# EAGLE schematic FR4 6.0 (EAGLE 7.2.0)
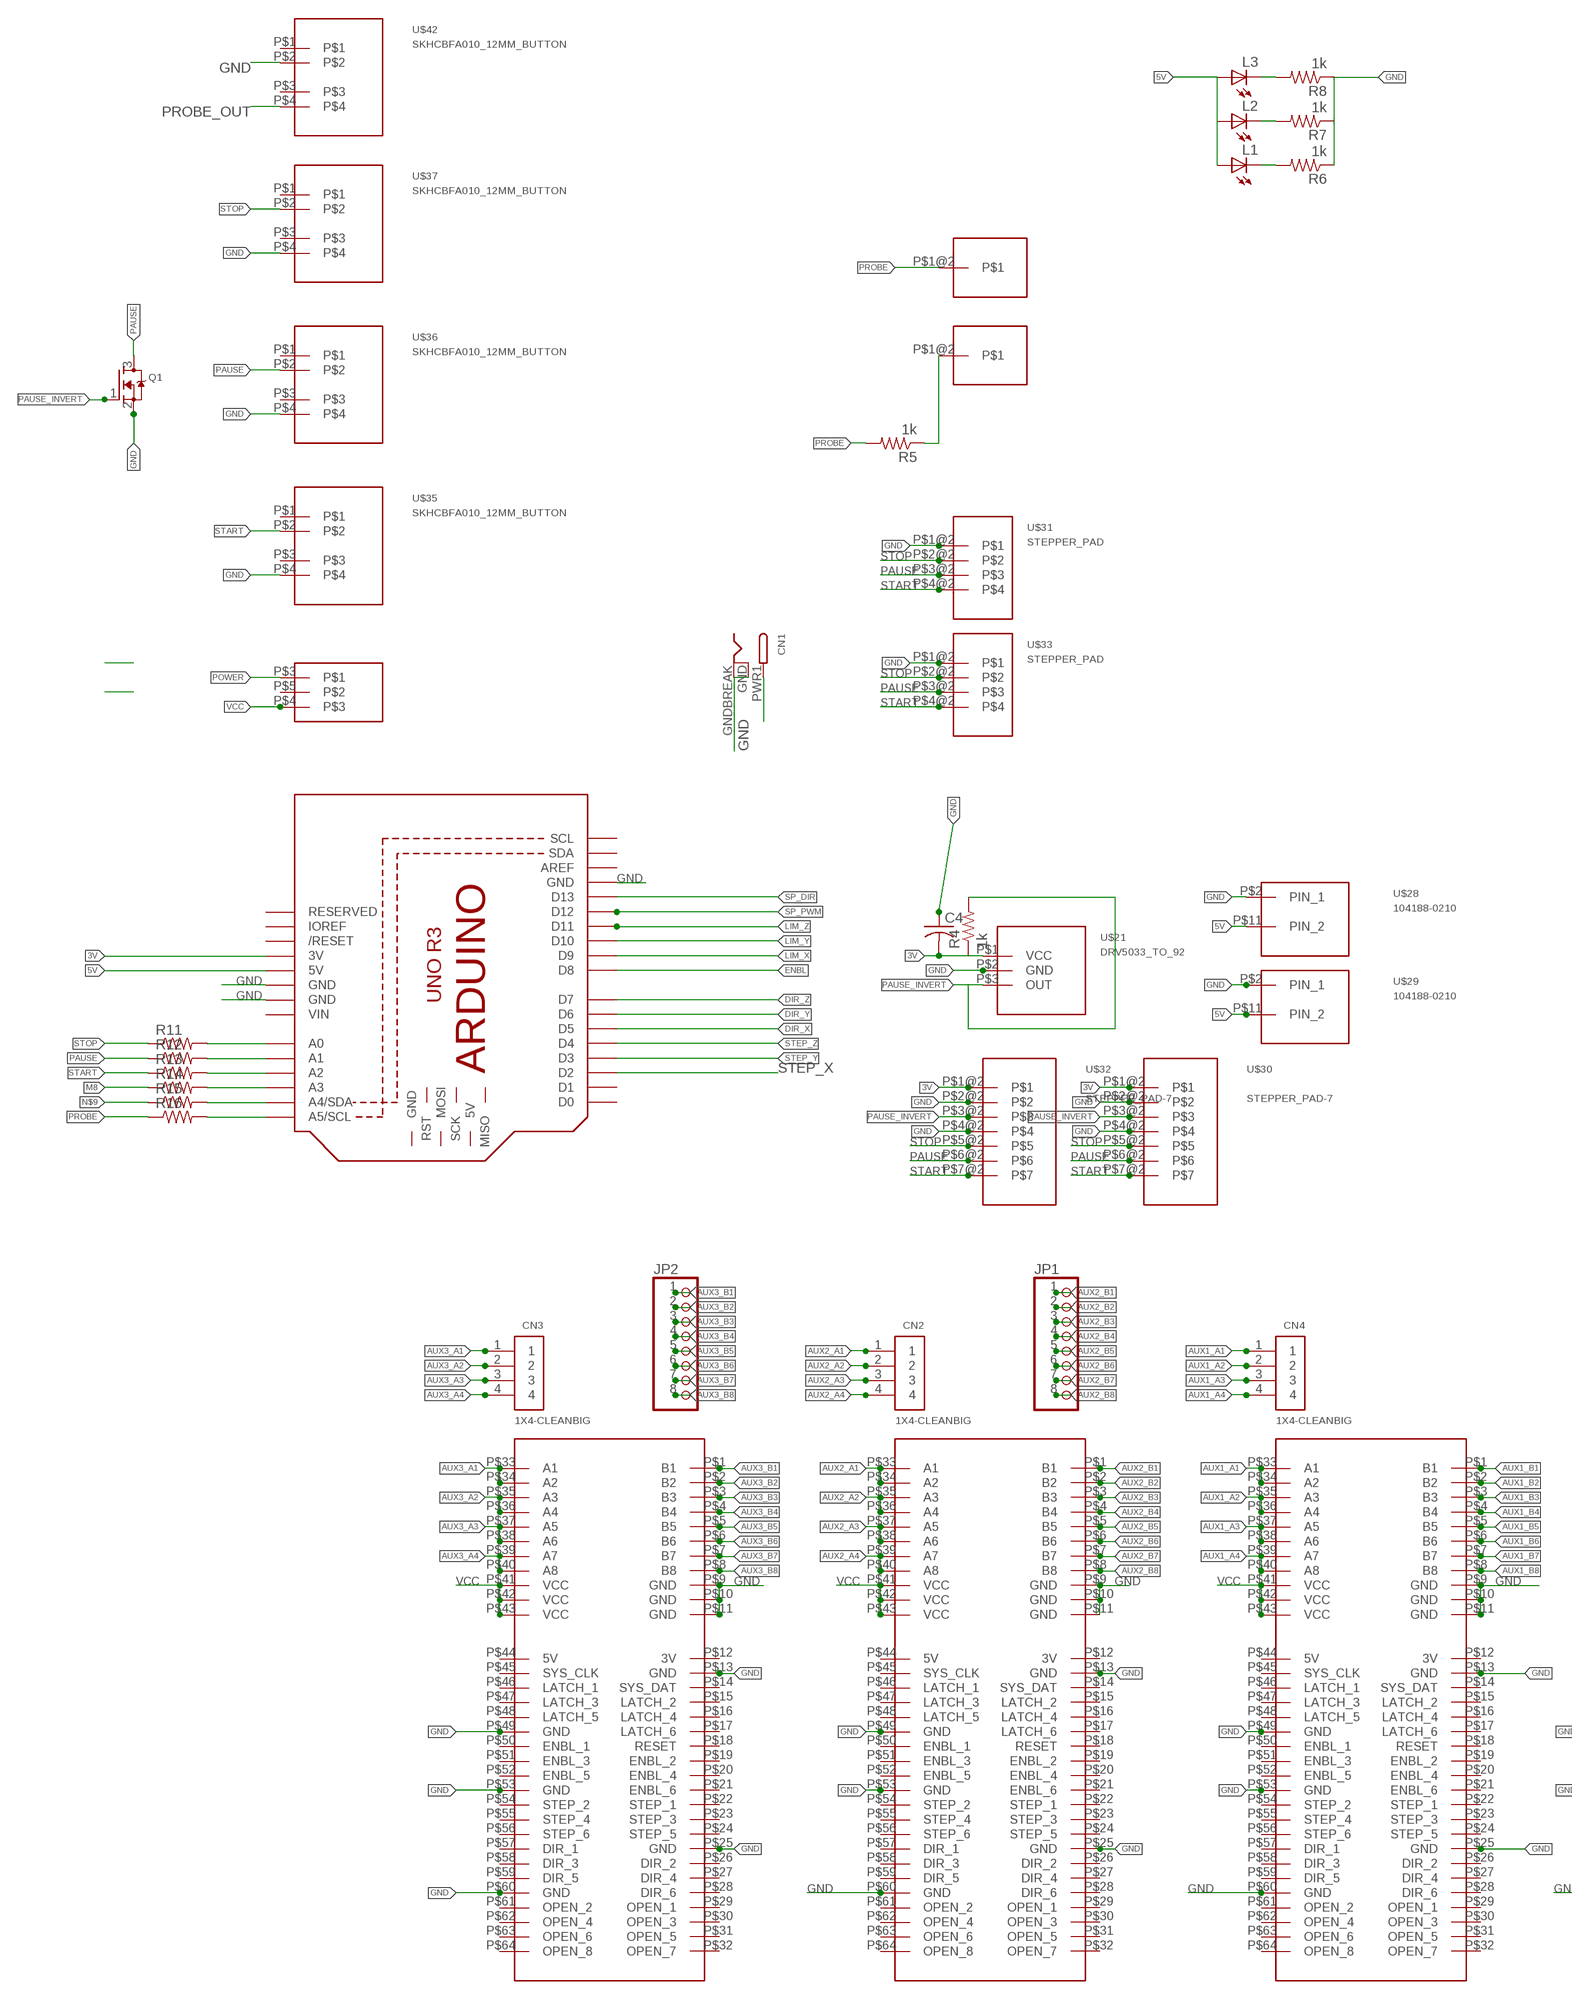
[diagram p0: schematic, sheet 1, part 1 of 2]
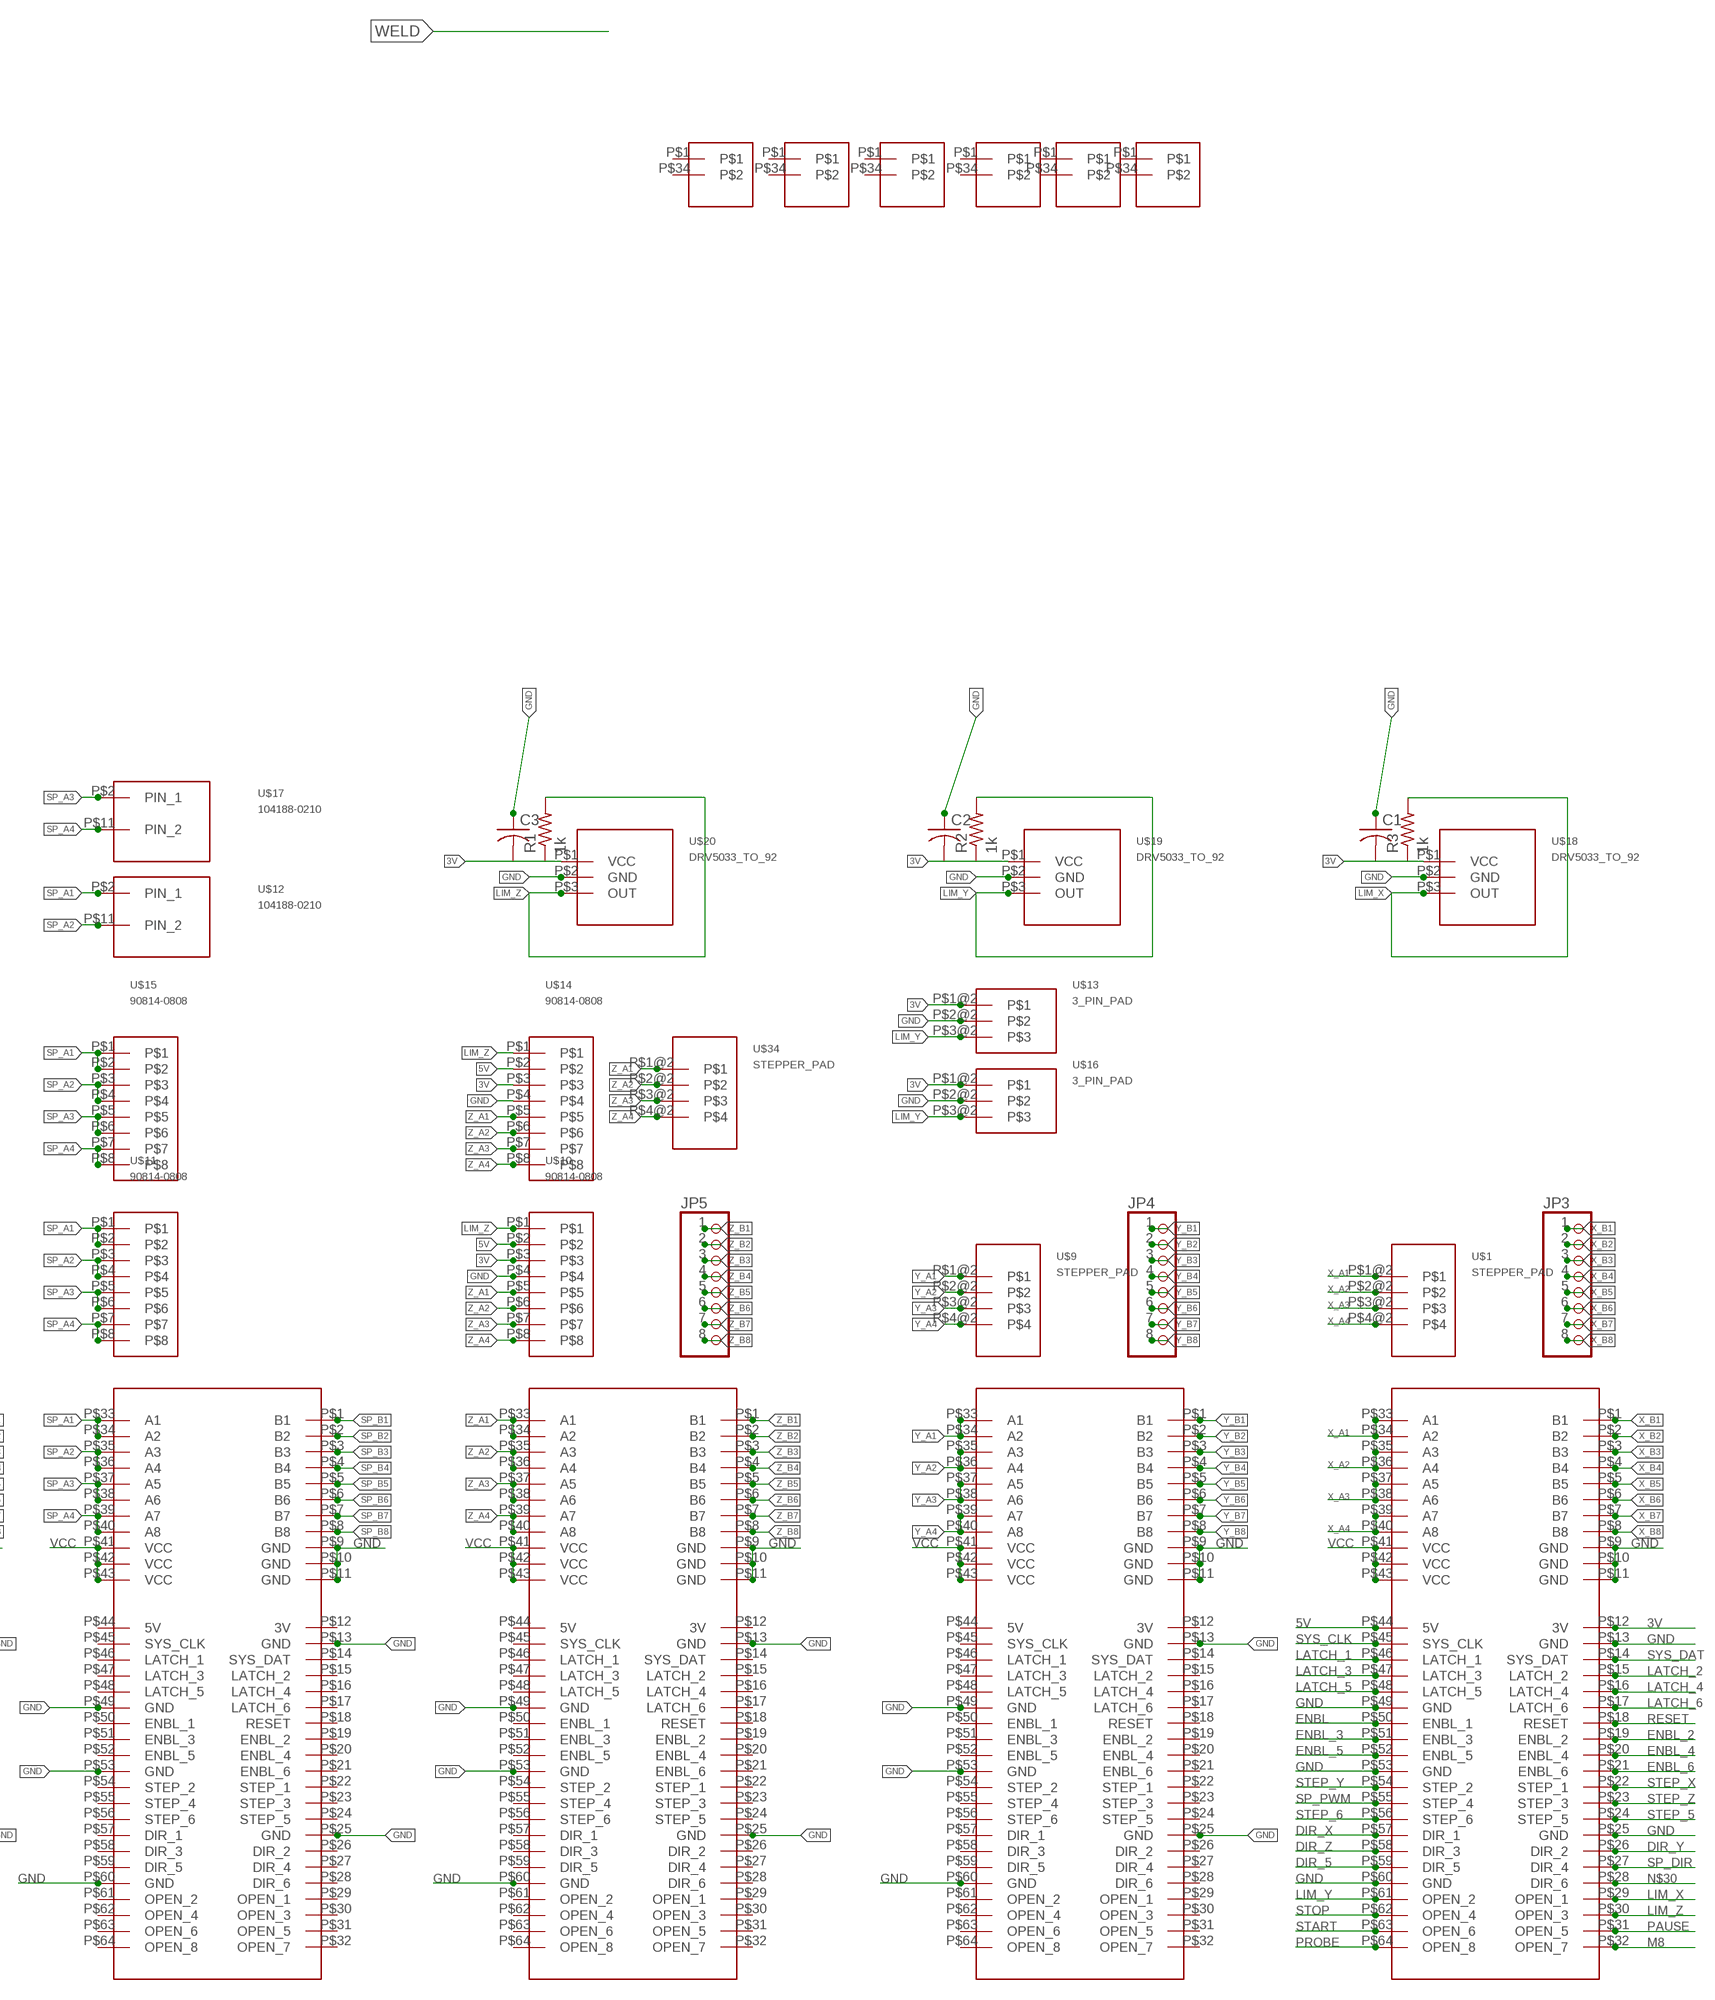
[diagram p1: schematic, sheet 1, part 2 of 2]

## Parts
C1  C-USC1210  [C1210]
C2  C-USC1210  [C1210]
C3  C-USC1210  [C1210]
C4  C-USC1210  [C1210]
CN1  DCBARRELSMT  [DCJACK_2MM_SMT]
CN2  1X4-CLEANBIG  [1X04-CLEANBIG]
CN3  1X4-CLEANBIG  [1X04-CLEANBIG]
CN4  1X4-CLEANBIG  [1X04-CLEANBIG]
JP1  PINHD-1X8CLEANBIG  [1X08-CLEANBIG]
JP2  PINHD-1X8CLEANBIG  [1X08-CLEANBIG]
JP3  PINHD-1X8CLEANBIG  [1X08-CLEANBIG]
JP4  PINHD-1X8CLEANBIG  [1X08-CLEANBIG]
JP5  PINHD-1X8CLEANBIG  [1X08-CLEANBIG]
L1  LEDCHIPLED_1206  [CHIPLED_1206]
L2  LEDCHIPLED_1206  [CHIPLED_1206]
L3  LEDCHIPLED_1206  [CHIPLED_1206]
M1  ARDUINO_R3_ICSP  [ARDUINOR3_ICSP]
Q1  MOSFET-NREFLOW  [SOT23]
R1  1k  R-US_R1210  [R1210]
R2  1k  R-US_R1210  [R1210]
R3  1k  R-US_R1210  [R1210]
R4  1k  R-US_R1210  [R1210]
R5  1k  R-US_R1210  [R1210]
R6  1k  R-US_R1210  [R1210]
R7  1k  R-US_R1210  [R1210]
R8  1k  R-US_R1210  [R1210]
R11  R-US_R1206  [R1206]
R12  R-US_R1206  [R1206]
R13  R-US_R1206  [R1206]
R14  R-US_R1206  [R1206]
R15  R-US_R1206  [R1206]
R16  R-US_R1206  [R1206]
U$1  STEPPER_PAD  [STEPPER_PAD]
U$2  10018784-10211TLF-TRACE  [10018784-10211TLF-TRACE]
U$3  10018784-10211TLF-TRACE  [10018784-10211TLF-TRACE]
U$4  10018784-10211TLF-TRACE  [10018784-10211TLF-TRACE]
U$5  10018784-10211TLF-TRACE  [10018784-10211TLF-TRACE]
U$6  10018784-10211TLF-TRACE  [10018784-10211TLF-TRACE]
U$7  10018784-10211TLF-TRACE  [10018784-10211TLF-TRACE]
U$8  10018784-10211TLF-  [1001874-10211TLF-]
U$9  STEPPER_PAD  [STEPPER_PAD]
U$10  90814-0808  [90814-0808]
U$11  90814-0808  [90814-0808]
U$12  104188-0210  [104188-0210]
U$13  3_PIN_PAD  [3_WIRE_PAD]
U$14  90814-0808  [90814-0808]
U$15  90814-0808  [90814-0808]
U$16  3_PIN_PAD  [3_WIRE_PAD]
U$17  104188-0210  [104188-0210]
U$18  DRV5033_TO_92  [DRV5033_TO_92]
U$19  DRV5033_TO_92  [DRV5033_TO_92]
U$20  DRV5033_TO_92  [DRV5033_TO_92]
U$21  DRV5033_TO_92  [DRV5033_TO_92]
U$22  WELDPAD_.79X.353  [WELDPAD_.79X.353]
U$23  WELDPAD_.79X.353  [WELDPAD_.79X.353]
U$24  WELDPAD_.79X.353  [WELDPAD_.79X.353]
U$25  WELDPAD_.79X.353  [WELDPAD_.79X.353]
U$26  WELDPAD_.79X.353  [WELDPAD_.79X.353]
U$27  WELDPAD_.79X.353  [WELDPAD_.79X.353]
U$28  104188-0210  [104188-0210]
U$29  104188-0210  [104188-0210]
U$30  STEPPER_PAD-7  [STEPPER_PAD-7]
U$31  STEPPER_PAD  [STEPPER_PAD]
U$32  STEPPER_PAD-7  [STEPPER_PAD-7]
U$33  STEPPER_PAD  [STEPPER_PAD]
U$34  STEPPER_PAD  [STEPPER_PAD]
U$35  SKHCBFA010_12MM_BUTTON  [12MM_BUTTON]
U$36  SKHCBFA010_12MM_BUTTON  [12MM_BUTTON]
U$37  SKHCBFA010_12MM_BUTTON  [12MM_BUTTON]
U$39  1PIN_PAD  [1PIN_PAD]
U$40  1PIN_PAD  [1PIN_PAD]
U$41  100SP1T2B4M6QE  [100SP1T2B4M6QE]
U$42  SKHCBFA010_12MM_BUTTON  [12MM_BUTTON]

## Nets
3V: C1.2 C2.2 C3.2 C4.2 M1.3V R1.1 R2.1 R3.1 R4.1 U$8.P$12(3V) U$10.P$3 U$13.P$1@2 U$14.P$3 U$16.P$1@2 U$18.P$1(VCC) U$19.P$1(VCC) U$20.P$1(VCC) U$21.P$1(VCC) U$30.P$1@2 U$32.P$1@2
5V: L1.A L2.A L3.A M1.5V U$8.P$44(5V) U$10.P$2 U$14.P$2 U$28.P$11(PIN_2) U$29.P$11(PIN_2)
AUX1_A1: CN4.1 U$4.P$33(A1) U$4.P$34(A2)
AUX1_A2: CN4.2 U$4.P$35(A3) U$4.P$36(A4)
AUX1_A3: CN4.3 U$4.P$37(A5) U$4.P$38(A6)
AUX1_A4: CN4.4 U$4.P$39(A7) U$4.P$40(A8)
AUX1_B1: U$4.P$1(B1)
AUX1_B2: U$4.P$2(B2)
AUX1_B3: U$4.P$3(B3)
AUX1_B4: U$4.P$4(B4)
AUX1_B5: U$4.P$5(B5)
AUX1_B6: U$4.P$6(B6)
AUX1_B7: U$4.P$7(B7)
AUX1_B8: U$4.P$8(B8)
AUX2_A1: CN2.1 U$3.P$33(A1) U$3.P$34(A2)
AUX2_A2: CN2.2 U$3.P$35(A3) U$3.P$36(A4)
AUX2_A3: CN2.3 U$3.P$37(A5) U$3.P$38(A6)
AUX2_A4: CN2.4 U$3.P$39(A7) U$3.P$40(A8)
AUX2_B1: JP1.1 U$3.P$1(B1)
AUX2_B2: JP1.2 U$3.P$2(B2)
AUX2_B3: JP1.3 U$3.P$3(B3)
AUX2_B4: JP1.4 U$3.P$4(B4)
AUX2_B5: JP1.5 U$3.P$5(B5)
AUX2_B6: JP1.6 U$3.P$6(B6)
AUX2_B7: JP1.7 U$3.P$7(B7)
AUX2_B8: JP1.8 U$3.P$8(B8)
AUX3_A1: CN3.1 U$2.P$33(A1) U$2.P$34(A2)
AUX3_A2: CN3.2 U$2.P$35(A3) U$2.P$36(A4)
AUX3_A3: CN3.3 U$2.P$37(A5) U$2.P$38(A6)
AUX3_A4: CN3.4 U$2.P$39(A7) U$2.P$40(A8)
AUX3_B1: JP2.1 U$2.P$1(B1)
AUX3_B2: JP2.2 U$2.P$2(B2)
AUX3_B3: JP2.3 U$2.P$3(B3)
AUX3_B4: JP2.4 U$2.P$4(B4)
AUX3_B5: JP2.5 U$2.P$5(B5)
AUX3_B6: JP2.6 U$2.P$6(B6)
AUX3_B7: JP2.7 U$2.P$7(B7)
AUX3_B8: JP2.8 U$2.P$8(B8)
DIR_5: U$8.P$59(DIR_5)
DIR_X: M1.D5 U$8.P$57(DIR_1)
DIR_Y: M1.D6 U$8.P$26(DIR_2)
DIR_Z: M1.D7 U$8.P$58(DIR_3)
ENBL: M1.D8 U$8.P$50(ENBL_1)
ENBL_2: U$8.P$19(ENBL_2)
ENBL_3: U$8.P$51(ENBL_3)
ENBL_4: U$8.P$20(ENBL_4)
ENBL_5: U$8.P$52(ENBL_5)
ENBL_6: U$8.P$21(ENBL_6)
GND: C1.1 C2.1 C3.1 C4.1 CN1.GND(GNDBREAK) CN1.GNDBREAK(GND) M1.GND M1.GND@1(GND) M1.GND@3(GND) Q1.2(S) R6.1 R7.1 R8.1 U$2.P$9(GND) U$2.P$10(GND) U$2.P$11(GND) U$2.P$13(GND) U$2.P$25(GND) U$2.P$49(GND) U$2.P$53(GND) U$2.P$60(GND) U$3.P$9(GND) U$3.P$10(GND) U$3.P$11(GND) U$3.P$13(GND) U$3.P$25(GND) U$3.P$49(GND) U$3.P$53(GND) U$3.P$60(GND) U$4.P$9(GND) U$4.P$10(GND) U$4.P$11(GND) U$4.P$13(GND) U$4.P$25(GND) U$4.P$49(GND) U$4.P$53(GND) U$4.P$60(GND) U$5.P$9(GND) U$5.P$10(GND) U$5.P$11(GND) U$5.P$13(GND) U$5.P$25(GND) U$5.P$49(GND) U$5.P$53(GND) U$5.P$60(GND) U$6.P$9(GND) U$6.P$10(GND) U$6.P$11(GND) U$6.P$13(GND) U$6.P$25(GND) U$6.P$49(GND) U$6.P$53(GND) U$6.P$60(GND) U$7.P$9(GND) U$7.P$10(GND) U$7.P$11(GND) U$7.P$13(GND) U$7.P$25(GND) U$7.P$49(GND) U$7.P$53(GND) U$7.P$60(GND) U$8.P$9(GND) U$8.P$10(GND) U$8.P$11(GND) U$8.P$13(GND) U$8.P$25(GND) U$8.P$49(GND) U$8.P$53(GND) U$8.P$60(GND) U$10.P$4 U$13.P$2@2 U$14.P$4 U$16.P$2@2 U$18.P$2(GND) U$19.P$2(GND) U$20.P$2(GND) U$21.P$2(GND) U$28.P$2(PIN_1) U$29.P$2(PIN_1) U$30.P$2@2 U$30.P$4@2 U$31.P$1@2 U$32.P$2@2 U$32.P$4@2 U$33.P$1@2 U$35.P$4 U$36.P$4 U$37.P$4 U$42.P$2
LATCH_1: U$8.P$46(LATCH_1)
LATCH_2: U$8.P$15(LATCH_2)
LATCH_3: U$8.P$47(LATCH_3)
LATCH_4: U$8.P$16(LATCH_4)
LATCH_5: U$8.P$48(LATCH_5)
LATCH_6: U$8.P$17(LATCH_6)
LIM_X: M1.D9 R3.2 U$8.P$29(OPEN_1) U$18.P$3(OUT)
LIM_Y: M1.D10 R2.2 U$8.P$61(OPEN_2) U$13.P$3@2 U$16.P$3@2 U$19.P$3(OUT)
LIM_Z: M1.D11 R1.2 U$8.P$30(OPEN_3) U$10.P$1 U$14.P$1 U$20.P$3(OUT)
M8: R14.1 U$8.P$32(OPEN_7)
N$8: L1.C R6.2
N$9: R15.1
N$10: L2.C R7.2
N$11: L3.C R8.2
N$12: M1.A0 R11.2
N$13: M1.A1 R12.2
N$17: M1.A2 R13.2
N$18: M1.A3 R14.2
N$19: M1.A4(A4/SDA) R15.2
N$20: M1.A5(A5/SCL) R16.2
N$30: U$8.P$28(DIR_6)
PAUSE: Q1.3(D) R12.1 U$8.P$31(OPEN_5) U$30.P$6@2 U$31.P$3@2 U$32.P$6@2 U$33.P$3@2 U$36.P$2
PAUSE_INVERT: Q1.1(G) R4.2 U$21.P$3(OUT) U$30.P$3@2 U$32.P$3@2
POWER: CN1.PWR1(PWR) U$41.P$3
PROBE: R5.2 R16.1 U$8.P$64(OPEN_8) U$40.P$1@2
PROBE_OUT: R5.1 U$39.P$1@2 U$42.P$4
RESET: U$8.P$18(RESET)
SP_A1: U$5.P$33(A1) U$5.P$34(A2) U$11.P$1 U$11.P$2 U$12.P$2(PIN_1) U$15.P$1 U$15.P$2
SP_A2: U$5.P$35(A3) U$5.P$36(A4) U$11.P$3 U$11.P$4 U$12.P$11(PIN_2) U$15.P$3 U$15.P$4
SP_A3: U$5.P$37(A5) U$5.P$38(A6) U$11.P$5 U$11.P$6 U$15.P$5 U$15.P$6 U$17.P$2(PIN_1)
SP_A4: U$5.P$39(A7) U$5.P$40(A8) U$11.P$7 U$11.P$8 U$15.P$7 U$15.P$8 U$17.P$11(PIN_2)
SP_B1: U$5.P$1(B1)
SP_B2: U$5.P$2(B2)
SP_B3: U$5.P$3(B3)
SP_B4: U$5.P$4(B4)
SP_B5: U$5.P$5(B5)
SP_B6: U$5.P$6(B6)
SP_B7: U$5.P$7(B7)
SP_B8: U$5.P$8(B8)
SP_DIR: M1.D13 U$8.P$27(DIR_4)
SP_PWM: M1.D12 U$8.P$55(STEP_4)
START: R13.1 U$8.P$63(OPEN_6) U$30.P$7@2 U$31.P$4@2 U$32.P$7@2 U$33.P$4@2 U$35.P$2
STEP_5: U$8.P$24(STEP_5)
STEP_6: U$8.P$56(STEP_6)
STEP_X: M1.D2 U$8.P$22(STEP_1)
STEP_Y: M1.D3 U$8.P$54(STEP_2)
STEP_Z: M1.D4 U$8.P$23(STEP_3)
STOP: R11.1 U$8.P$62(OPEN_4) U$30.P$5@2 U$31.P$2@2 U$32.P$5@2 U$33.P$2@2 U$37.P$2
SYS_CLK: U$8.P$45(SYS_CLK)
SYS_DAT: U$8.P$14(SYS_DAT)
VCC: U$2.P$41(VCC) U$2.P$42(VCC) U$2.P$43(VCC) U$3.P$41(VCC) U$3.P$42(VCC) U$3.P$43(VCC) U$4.P$41(VCC) U$4.P$42(VCC) U$4.P$43(VCC) U$5.P$41(VCC) U$5.P$42(VCC) U$5.P$43(VCC) U$6.P$41(VCC) U$6.P$42(VCC) U$6.P$43(VCC) U$7.P$41(VCC) U$7.P$42(VCC) U$7.P$43(VCC) U$8.P$41(VCC) U$8.P$42(VCC) U$8.P$43(VCC) U$41.P$4
X_A1: U$1.P$1@2 U$8.P$33(A1) U$8.P$34(A2)
X_A2: U$1.P$2@2 U$8.P$35(A3) U$8.P$36(A4)
X_A3: U$1.P$3@2 U$8.P$37(A5) U$8.P$38(A6)
X_A4: U$1.P$4@2 U$8.P$39(A7) U$8.P$40(A8)
X_B1: JP3.1 U$8.P$1(B1)
X_B2: JP3.2 U$8.P$2(B2)
X_B3: JP3.3 U$8.P$3(B3)
X_B4: JP3.4 U$8.P$4(B4)
X_B5: JP3.5 U$8.P$5(B5)
X_B6: JP3.6 U$8.P$6(B6)
X_B7: JP3.7 U$8.P$7(B7)
X_B8: JP3.8 U$8.P$8(B8)
Y_A1: U$7.P$33(A1) U$7.P$34(A2) U$9.P$1@2
Y_A2: U$7.P$35(A3) U$7.P$36(A4) U$9.P$2@2
Y_A3: U$7.P$37(A5) U$7.P$38(A6) U$9.P$3@2
Y_A4: U$7.P$39(A7) U$7.P$40(A8) U$9.P$4@2
Y_B1: JP4.1 U$7.P$1(B1)
Y_B2: JP4.2 U$7.P$2(B2)
Y_B3: JP4.3 U$7.P$3(B3)
Y_B4: JP4.4 U$7.P$4(B4)
Y_B5: JP4.5 U$7.P$5(B5)
Y_B6: JP4.6 U$7.P$6(B6)
Y_B7: JP4.7 U$7.P$7(B7)
Y_B8: JP4.8 U$7.P$8(B8)
Z_A1: U$6.P$33(A1) U$6.P$34(A2) U$10.P$5 U$14.P$5 U$34.P$1@2
Z_A2: U$6.P$35(A3) U$6.P$36(A4) U$10.P$6 U$14.P$6 U$34.P$2@2
Z_A3: U$6.P$37(A5) U$6.P$38(A6) U$10.P$7 U$14.P$7 U$34.P$3@2
Z_A4: U$6.P$39(A7) U$6.P$40(A8) U$10.P$8 U$14.P$8 U$34.P$4@2
Z_B1: JP5.1 U$6.P$1(B1)
Z_B2: JP5.2 U$6.P$2(B2)
Z_B3: JP5.3 U$6.P$3(B3)
Z_B4: JP5.4 U$6.P$4(B4)
Z_B5: JP5.5 U$6.P$5(B5)
Z_B6: JP5.6 U$6.P$6(B6)
Z_B7: JP5.7 U$6.P$7(B7)
Z_B8: JP5.8 U$6.P$8(B8)
Unconnected: M1.5V_ICSP(5V) M1.AREF M1.D0 M1.D1 M1.GND@2(GND) M1.IOREF M1.MISO M1.MOSI M1.RESERVED M1.RESET(/RESET) M1.RESET_ICSP(RST) M1.SCK M1.SCL M1.SDA U$2.P$12(3V) U$2.P$14(SYS_DAT) U$2.P$15(LATCH_2) U$2.P$16(LATCH_4) U$2.P$17(LATCH_6) U$2.P$18(RESET) U$2.P$19(ENBL_2) U$2.P$20(ENBL_4) U$2.P$21(ENBL_6) U$2.P$22(STEP_1) U$2.P$23(STEP_3) U$2.P$24(STEP_5) U$2.P$26(DIR_2) U$2.P$27(DIR_4) U$2.P$28(DIR_6) U$2.P$29(OPEN_1) U$2.P$30(OPEN_3) U$2.P$31(OPEN_5) U$2.P$32(OPEN_7) U$2.P$44(5V) U$2.P$45(SYS_CLK) U$2.P$46(LATCH_1) U$2.P$47(LATCH_3) U$2.P$48(LATCH_5) U$2.P$50(ENBL_1) U$2.P$51(ENBL_3) U$2.P$52(ENBL_5) U$2.P$54(STEP_2) U$2.P$55(STEP_4) U$2.P$56(STEP_6) U$2.P$57(DIR_1) U$2.P$58(DIR_3) U$2.P$59(DIR_5) U$2.P$61(OPEN_2) U$2.P$62(OPEN_4) U$2.P$63(OPEN_6) U$2.P$64(OPEN_8) U$3.P$12(3V) U$3.P$14(SYS_DAT) U$3.P$15(LATCH_2) U$3.P$16(LATCH_4) U$3.P$17(LATCH_6) U$3.P$18(RESET) U$3.P$19(ENBL_2) U$3.P$20(ENBL_4) U$3.P$21(ENBL_6) U$3.P$22(STEP_1) U$3.P$23(STEP_3) U$3.P$24(STEP_5) U$3.P$26(DIR_2) U$3.P$27(DIR_4) U$3.P$28(DIR_6) U$3.P$29(OPEN_1) U$3.P$30(OPEN_3) U$3.P$31(OPEN_5) U$3.P$32(OPEN_7) U$3.P$44(5V) U$3.P$45(SYS_CLK) U$3.P$46(LATCH_1) U$3.P$47(LATCH_3) U$3.P$48(LATCH_5) U$3.P$50(ENBL_1) U$3.P$51(ENBL_3) U$3.P$52(ENBL_5) U$3.P$54(STEP_2) U$3.P$55(STEP_4) U$3.P$56(STEP_6) U$3.P$57(DIR_1) U$3.P$58(DIR_3) U$3.P$59(DIR_5) U$3.P$61(OPEN_2) U$3.P$62(OPEN_4) U$3.P$63(OPEN_6) U$3.P$64(OPEN_8) U$4.P$12(3V) U$4.P$14(SYS_DAT) U$4.P$15(LATCH_2) U$4.P$16(LATCH_4) U$4.P$17(LATCH_6) U$4.P$18(RESET) U$4.P$19(ENBL_2) U$4.P$20(ENBL_4) U$4.P$21(ENBL_6) U$4.P$22(STEP_1) U$4.P$23(STEP_3) U$4.P$24(STEP_5) U$4.P$26(DIR_2) U$4.P$27(DIR_4) U$4.P$28(DIR_6) U$4.P$29(OPEN_1) U$4.P$30(OPEN_3) U$4.P$31(OPEN_5) U$4.P$32(OPEN_7) U$4.P$44(5V) U$4.P$45(SYS_CLK) U$4.P$46(LATCH_1) U$4.P$47(LATCH_3) U$4.P$48(LATCH_5) U$4.P$50(ENBL_1) U$4.P$51(ENBL_3) U$4.P$52(ENBL_5) U$4.P$54(STEP_2) U$4.P$55(STEP_4) U$4.P$56(STEP_6) U$4.P$57(DIR_1) U$4.P$58(DIR_3) U$4.P$59(DIR_5) U$4.P$61(OPEN_2) U$4.P$62(OPEN_4) U$4.P$63(OPEN_6) U$4.P$64(OPEN_8) U$5.P$12(3V) U$5.P$14(SYS_DAT) U$5.P$15(LATCH_2) U$5.P$16(LATCH_4) U$5.P$17(LATCH_6) U$5.P$18(RESET) U$5.P$19(ENBL_2) U$5.P$20(ENBL_4) U$5.P$21(ENBL_6) U$5.P$22(STEP_1) U$5.P$23(STEP_3) U$5.P$24(STEP_5) U$5.P$26(DIR_2) U$5.P$27(DIR_4) U$5.P$28(DIR_6) U$5.P$29(OPEN_1) U$5.P$30(OPEN_3) U$5.P$31(OPEN_5) U$5.P$32(OPEN_7) U$5.P$44(5V) U$5.P$45(SYS_CLK) U$5.P$46(LATCH_1) U$5.P$47(LATCH_3) U$5.P$48(LATCH_5) U$5.P$50(ENBL_1) U$5.P$51(ENBL_3) U$5.P$52(ENBL_5) U$5.P$54(STEP_2) U$5.P$55(STEP_4) U$5.P$56(STEP_6) U$5.P$57(DIR_1) U$5.P$58(DIR_3) U$5.P$59(DIR_5) U$5.P$61(OPEN_2) U$5.P$62(OPEN_4) U$5.P$63(OPEN_6) U$5.P$64(OPEN_8) U$6.P$12(3V) U$6.P$14(SYS_DAT) U$6.P$15(LATCH_2) U$6.P$16(LATCH_4) U$6.P$17(LATCH_6) U$6.P$18(RESET) U$6.P$19(ENBL_2) U$6.P$20(ENBL_4) U$6.P$21(ENBL_6) U$6.P$22(STEP_1) U$6.P$23(STEP_3) U$6.P$24(STEP_5) U$6.P$26(DIR_2) U$6.P$27(DIR_4) U$6.P$28(DIR_6) U$6.P$29(OPEN_1) U$6.P$30(OPEN_3) U$6.P$31(OPEN_5) U$6.P$32(OPEN_7) U$6.P$44(5V) U$6.P$45(SYS_CLK) U$6.P$46(LATCH_1) U$6.P$47(LATCH_3) U$6.P$48(LATCH_5) U$6.P$50(ENBL_1) U$6.P$51(ENBL_3) U$6.P$52(ENBL_5) U$6.P$54(STEP_2) U$6.P$55(STEP_4) U$6.P$56(STEP_6) U$6.P$57(DIR_1) U$6.P$58(DIR_3) U$6.P$59(DIR_5) U$6.P$61(OPEN_2) U$6.P$62(OPEN_4) U$6.P$63(OPEN_6) U$6.P$64(OPEN_8) U$7.P$12(3V) U$7.P$14(SYS_DAT) U$7.P$15(LATCH_2) U$7.P$16(LATCH_4) U$7.P$17(LATCH_6) U$7.P$18(RESET) U$7.P$19(ENBL_2) U$7.P$20(ENBL_4) U$7.P$21(ENBL_6) U$7.P$22(STEP_1) U$7.P$23(STEP_3) U$7.P$24(STEP_5) U$7.P$26(DIR_2) U$7.P$27(DIR_4) U$7.P$28(DIR_6) U$7.P$29(OPEN_1) U$7.P$30(OPEN_3) U$7.P$31(OPEN_5) U$7.P$32(OPEN_7) U$7.P$44(5V) U$7.P$45(SYS_CLK) U$7.P$46(LATCH_1) U$7.P$47(LATCH_3) U$7.P$48(LATCH_5) U$7.P$50(ENBL_1) U$7.P$51(ENBL_3) U$7.P$52(ENBL_5) U$7.P$54(STEP_2) U$7.P$55(STEP_4) U$7.P$56(STEP_6) U$7.P$57(DIR_1) U$7.P$58(DIR_3) U$7.P$59(DIR_5) U$7.P$61(OPEN_2) U$7.P$62(OPEN_4) U$7.P$63(OPEN_6) U$7.P$64(OPEN_8) U$22.P$1 U$22.P$34 U$23.P$1 U$23.P$34 U$24.P$1 U$24.P$34 U$25.P$1 U$25.P$34 U$26.P$1 U$26.P$34 U$27.P$1 U$27.P$34 U$35.P$1 U$35.P$3 U$36.P$1 U$36.P$3 U$37.P$1 U$37.P$3 U$41.P$5 U$42.P$1 U$42.P$3

## Power pins joined to a net without a drawn wire
VIN: M1.VIN

## Library data of the parts
C1-C4 = adafruit:C-US: CAPACITOR, American symbol
CN1 = adafruit:DCBARREL: 2.0mm DC Barrel Jack DCJACK_2MM_PTH - Through Hole Jack (4UConnector: 05537)
CN2-CN4 = adafruit:1X4: 4-pin connector
JP1-JP5 = adafruit:PINHD-1X8: PIN HEADER
L1-L3 = adafruit:LED: LED OSRAM: - CHIPLED LG R971, LG N971, LY N971, LG Q971, LY Q971, LO R971, LY R971 LH N974, LH R974 LS Q976, LO Q976, LY Q976 LO Q996 - Hyper CHIPLED LW Q18S LB Q993, LB Q99A, LB R99A - SideLED LS A670, LO A670, LY A670, LG A670, LP A670 LB A673, LV A673, LT A673, LW A673 LH A674 LY A675 LS A676, LA A676, LO A676, LY A676, LW A676 LS A679, LY A679, LG A679 - Hyper Micro SIDELED® LS Y876, LA Y876, LO Y876, LY Y876 LT Y87S - SmartLED LW L88C, LW L88S LB L89C, LB L89S, LG L890 LS L89K, LO L89K, LY L89K LS L896, LA L896, LO L896, LY L896 - TOPLED LS T670, LO T670, LY T670, LG T670, LP T670 LSG T670, LSP T670, LSY T670, LOP T670, LYG T670 LG T671, LOG T671, LSG T671 LB T673, LV T673, LT T673, LW T673 LH T674 LS T676, LA T676, LO T676, LY T676, LB T676, LH T676, LSB T676, LW T676 LB T67C, LV T67C, LT T67C, LS T67K, LO T67K, LY T67K, LW E67C LS E67B, LA E67B, LO E67B, LY E67B, LB E67C, LV E67C, LT E67C LW T67C LS T679, LY T679, LG T679 LS T770, LO T770, LY T770, LG T770, LP T770 LB T773, LV T773, LT T773, LW T773 LH T774 LS E675, LA E675, LY E675, LS T675 LS T776, LA T776, LO T776, LY T776, LB T776 LHGB T686 LT T68C, LB T68C - Hyper Mini TOPLED® LB M676 - Mini TOPLED Santana® LG M470 LS M47K, LO M47K, LY M47K Source: http://www.osram.convergy.de/
M1 = adafruit:ARDUINO_R3_ICSP
Q1 = adafruit:MOSFET-N: N-Channel Mosfet 2N7002E - 60V 260mA SOT23 [Digikey: 2N7002ET1GOSTR-ND] - REEL BSH103 - 30V 850mA SOT23 [Digikey: 568-5013-1-ND]
R1-R8 R11-R16 = adafruit:R-US_: RESISTOR, American symbol
U$1 U$9 U$31 U$33 U$34 = PocketNC:STEPPER_PAD
U$2-U$7 = PocketNC:10018784-10211TLF-TRACE
U$8 = PocketNC:10018784-10211TLF-
U$10 U$11 U$14 U$15 = PocketNC:90814-0808
U$12 U$17 U$28 U$29 = PocketNC:104188-0210
U$13 U$16 = PocketNC:3_PIN_PAD
U$18-U$21 = PocketNC:DRV5033_TO_92
U$22-U$27 = PocketNC:WELDPAD_.79X.353
U$30 U$32 = PocketNC:STEPPER_PAD-7
U$35-U$37 U$42 = PocketNC:SKHCBFA010_12MM_BUTTON
U$39 U$40 = PocketNC:1PIN_PAD
U$41 = PocketNC:100SP1T2B4M6QE